# Altium project AutonomousVehicle_MotherBoard.PrjPcb (part 2 of 2)

## Sheet MotherBoard_Sensor_Communication.SchDoc
size A; SheetNumber: 7; SheetTotal: 9
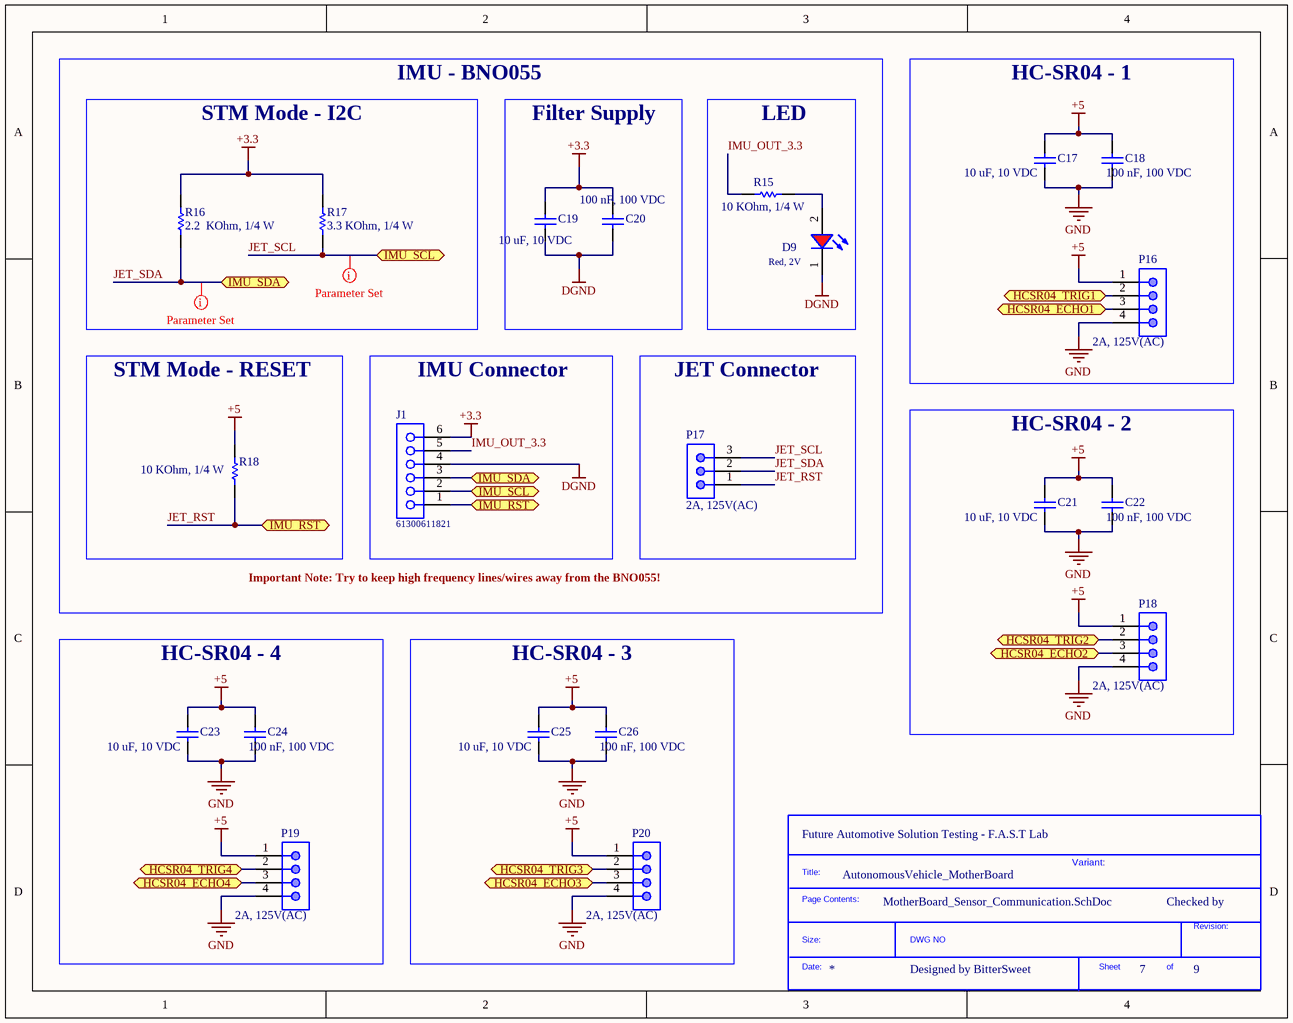
[diagram p6: MotherBoard_Sensor_Communication.SchDoc]

### Parts
(Parts that share a designator on the sheet are numbered #1, #2 ... from top to bottom, then left to right.)
*?#7  SDTitleBlock  (value not drawn)  (graphical)
C17  10 uF, 10 VDC  [CAP_0603]
C18  100 nF, 100 VDC  [CAP_0603]
C19  10 uF, 10 VDC  [CAP_0603]
C20  100 nF, 100 VDC  [CAP_0603]
C21  10 uF, 10 VDC  [CAP_0603]
C22  100 nF, 100 VDC  [CAP_0603]
C23  10 uF, 10 VDC  [CAP_0603]
C24  100 nF, 100 VDC  [CAP_0603]
C25  10 uF, 10 VDC  [CAP_0603]
C26  100 nF, 100 VDC  [CAP_0603]
D9  Red, 2V  [WL-SMCW_0603_H=0.7mm]
J1  61300611821  [61300611821]
P16  2A, 125V(AC)  [620104131822]
P17  2A, 125V(AC)  [620103131822]
P18  2A, 125V(AC)  [620104131822]
P19  2A, 125V(AC)  [620104131822]
P20  2A, 125V(AC)  [620104131822]
R15  10 KOhm, 1/4 W  [resistor_0603]
R16  2.2  KOhm, 1/4 W  [resistor_0603]
R17  3.3 KOhm, 1/4 W  [resistor_0603]
R18  10 KOhm, 1/4 W  [resistor_0603]

### Blocks framed on the sheet
HC-SR04 - 1: C17 C18 P16
Filter Supply: C19 C20
LED: D9 R15
STM Mode - RESET: R18
IMU Connector: J1
JET Connector: P17
HC-SR04 - 2: C21 C22 P18
HC-SR04 - 4: C23 C24 P19
HC-SR04 - 3: C25 C26 P20

### Ports
HCSR04_ECHO1 (bidir), HCSR04_ECHO2 (bidir), HCSR04_ECHO3 (bidir), HCSR04_ECHO4 (bidir), HCSR04_TRIG1 (bidir), HCSR04_TRIG2 (bidir), HCSR04_TRIG3 (bidir), HCSR04_TRIG4 (bidir), IMU_RST (bidir), IMU_SCL (bidir), IMU_SDA (bidir)

### Nets
+3.3: C19.2 C20.2 J1.6 R16.2 R17.2
+5: C17.2 C18.2 C21.2 C22.2 C23.2 C24.2 C25.2 C26.2 P16.1 P18.1 P19.1 P20.1 R18.2
DGND: C19.1 C20.1 D9.1(K) J1.4
GND: C17.1 C18.1 C21.1 C22.1 C23.1 C24.1 C25.1 C26.1 P16.4 P18.4 P19.4 P20.4
IMU_OUT_3.3: J1.5 R15.2
JET_RST: J1.1 P17.1 R18.1 ; port IMU_RST
JET_SCL: J1.2 P17.3 R17.1 ; port IMU_SCL
JET_SDA: J1.3 P17.2 R16.1 ; port IMU_SDA
NetD9_2: D9.2(A) R15.1
NetP16_2: P16.2 ; port HCSR04_TRIG1
NetP16_3: P16.3 ; port HCSR04_ECHO1
NetP18_2: P18.2 ; port HCSR04_TRIG2
NetP18_3: P18.3 ; port HCSR04_ECHO2
NetP19_2: P19.2 ; port HCSR04_TRIG4
NetP19_3: P19.3 ; port HCSR04_ECHO4
NetP20_2: P20.2 ; port HCSR04_TRIG3
NetP20_3: P20.3 ; port HCSR04_ECHO3

### Layout directives
net class IMU_I2C: JET_SCL, JET_SDA

### Notes on the sheet
- IMU - BNO055
- STM Mode - I2C
- Important Note: Try to keep high frequency lines/wires away from the BNO055!
- (near *?#7) Future Automotive Solution Testing - F.A.S.T Lab
- AutonomousVehicle_MotherBoard
- Variant:
- Checked by
- Designed by BitterSweet
- (in symbol SDTitleBlock) Title:; Page Contents:; Revision:; Size:; DWG NO; Date:; Sheet; of

### Library data of the parts
C17 C19 C21 C23 C25 = 0106031061010: CAP, size 0603, 10 uF, 10 VDC; Manufacture Name: Samsung Electro-Mechanics; Manufacture SN: CL10A106KP8NNWC; Capacitance: 10 uF; Tolerance: +/-10%; Voltage Rating DC: 10 VDC; ComponentLink2Description: Datasheet; ComponentLink2URL: https://www.mouser.vn/datasheet/2/585/MLCC-1837944.pdf; Operating Temperature: -55 to +125degC; Packaging: Tape and Reel; Mounting Technology: SMT; Size: 0603; Supplier 1 Name: Mouser; Supplier 1 SN: 187-CL10A106KP8NNWC; Supplier 1 URL: https://www.mouser.vn/ProductDetail/Samsung-Electro-Mechanics/CL10A106KP8NNWC?qs=xZ%2FP%252Ba9zWqZx8LSX23YqWA%3D%3D&utm_source=mouser-refine-download&utm_medium=file&utm_campaign=CL10A106KP8NNWC&utm_content=Samsung-Electro-Mechanics; Supplier 2 Name: Digi-Key; Supplier 2 SN: 1276-CL10A106KP8NNWCTR-ND; Supplier 2 URL: https://www.digikey.com/en/products/detail/samsung-electro-mechanics/cl10a106kp8nnwc/16572907; Supplier 3 Name: thegioiic; Supplier 3 SN: N/A; Supplier 3 URL: https://www.thegioiic.com/tu-gom-0603-10uf-25v; Value: 10 uF, 10 VDC; ComponentLink3Description: JLCPCB Link; ComponentLink3URL: https://jlcpcb.com/partdetail/Walsin_TechCorp-0603X106K100/C90806; JLCPCB Part: C90806
C18 C20 C22 C24 C26 = 0106031041050: CAP, size 0603, 100 nF, 16 VDC; Manufacture Name: TDK; Manufacture SN: CGA3E3X8R1H104K080AE; Capacitance: 100 nF; Tolerance: +/-10%; Voltage Rating DC: 16 VDC; ComponentLink2Description: Datasheet; ComponentLink2URL: https://product.tdk.com/system/files/dam/doc/product/capacitor/ceramic/mlcc/catalog/mlcc_automotive_soft_en.pdf?ref_disty=mouser; Operating Temperature: -55 to +125degC; Packaging: Tape and Reel; Mounting Technology: SMT; Size: 0603; Supplier 1 Name: Mouser; Supplier 1 SN: 810-CGA3E3X8R1H104KA; Supplier 1 URL: https://www.mouser.com/ProductDetail/TDK/CGA3E3X8R1H104K080AE?qs=nQSIdc08i%252Bd8g3IRRgU2bw%3D%3D&utm_source=mouser-refine-download&utm_medium=file&utm_campaign=CGA3E3X8R1H104K080AE&utm_content=TDK; Supplier 2 Name: Digi-Key; Supplier 2 SN: 445-173697-2-ND; Supplier 2 URL: https://www.digikey.com/en/products/detail/tdk-corporation/cga3e3x8r1h104k080ae/5809262; Supplier 3 Name: thegioiic; Supplier 3 SN: N/A; Supplier 3 URL: N/A; Value: 100 nF, 100 VDC; ComponentLink3Description: JLCPCB Link; ComponentLink3URL: https://jlcpcb.com/partdetail/89397-0603B104K101NT/C88219; JLCPCB Part: C88219
D9 = 160603RedClear: WL-SMCW SMT Mono-color Chip LED Waterclear, size 0603, Red, 2V, 140deg; Type: Clear; Color: Red; Size: 0603; ComponentLink1Description: Datasheet link; ComponentLink1URL: N/A; ComponentLink2Description: Supplier 1 URL; ComponentLink2URL: https://www.mouser.vn/ProductDetail/Wurth-Elektronik/150060RS75000?qs=LlUlMxKIyB3QnmZ3fw%2FVCA%3D%3D; ComponentLink3Description: Supplier 2 URL; ComponentLink3URL: https://www.digikey.com/en/products/detail/liteon/LTST-C191KRKT/386837; ComponentLink4Description: Supplier 3 URL; ComponentLink4URL: https://www.thegioiic.com/led-do-0603-dan-smd-trong-suot; Supplier 1 Name: Mouser; Supplier 1 SN: 710-150060RS75000; Supplier 1 URL: https://www.mouser.vn/ProductDetail/Wurth-Elektronik/150060RS75000?qs=LlUlMxKIyB3QnmZ3fw%2FVCA%3D%3D; Supplier 2 Name: Digi-Key; Supplier 2 SN: 160-1447-2-ND; Supplier 2 URL: https://www.digikey.com/en/products/detail/liteon/LTST-C191KRKT/386837; Supplier 3 Name: ICDayRoi; Supplier 3 SN: N/A; Supplier 3 URL: https://www.thegioiic.com/led-do-0603-dan-smd-trong-suot; Value: Red, 2V; ComponentLink5Description: JLCPCB Link; ComponentLink5URL: https://jlcpcb.com/partdetail/WURTHELEKTRONIK-150060RS75000/C3030991; JLCPCB Part: C3030991
J1 = 61300611821: WR-PHD Socket Header, THT, pitch 2.54mm, Single Row, Vertical, 6p; Manufacturer: Wurth Elektronik; Pin Number: 6; Rated Current: 3A; Working Voltage: 250VAC; Withstanding Voltage: 500VAC; Contact Resistance: 20mOhm; ComponentLink1Description: Manufacturer; ComponentLink1URL: http://www.we-online.de; ComponentLink2Description: Datasheet; ComponentLink2URL: https://www.we-online.com/catalog/datasheet/61300611821.pdf; Manufacturer Part Number: 61300611821; Published Date: May 2020; Pitch: 2.54mm; Operating Temperature: -40 to +125degC; Mounting Technology: THT; Packaging: Tray; Gender: Socket Header; Row Number: Single; Orientation: Vertical; ComponentLink3Description: Global Supply; ComponentLink3URL: https://www.we-online.com/en/components/products/PHD_2_54_SOCKET_HEADER_6130XX11821?sq=61300611821#61300611821; ComponentLink4Description: Global Supply; ComponentLink4URL: https://www.mouser.vn/ProductDetail/Wurth-Elektronik/61300611821?qs=iLbezkQI%252BsgS21jF2eozhA%3D%3D; ComponentLink5Description: Local Supply; ComponentLink5URL: https://www.thegioiic.com/hang-rao-cai-don-2-54mm-6-chan-1-hang-cao-11-8mm-xuyen-lo; Supplier 1 Name: Mouser; Supplier 1 SN: 710-61300611821; Supplier 1 URL: https://www.mouser.vn/ProductDetail/Wurth-Elektronik/61300611821?qs=iLbezkQI%252BsgS21jF2eozhA%3D%3D; Supplier 2 Name: Digi-Key; Supplier 2 SN: N/A; Supplier 2 URL: N/A; Supplier 3 Name: thegioiic; Supplier 3 SN: N/A; Supplier 3 URL: https://www.thegioiic.com/hang-rao-cai-don-2-54mm-6-chan-1-hang-cao-11-8mm-xuyen-lo
P16 P18-P20 = 620104131822: WR-WTB SMT Male Horizontal Shrouded Header, pitch 2mm, 4p; Pin Number: 4; Contact Resistance: 20mOhm; Withstanding Voltage: 800VAC; Working Voltage: 100VAC; ComponentLink1Description: Manufacturer; ComponentLink1URL: http://www.we-online.de; ComponentLink2Description: Datasheet; ComponentLink2URL: https://www.we-online.com/catalog/datasheet/620104131822.pdf; Pitch: 2mm; Published Date: January 2020; Publisher: Wurth Elektronik; Mounting Technology: SMT; Packaging: Tape and Reel; Operating Temperature: -25 to +85degC; Part Number: 620104131822; Gender: Male; Type: Horizontal; Rated Current: 2A; ComponentLink3Description: Global Supply; ComponentLink3URL: https://www.we-online.com/en/components/products/WTB_2_00_SMT_MALE_HORIZONTAL_SHROUDED_HEADER_6201XX131822?sq=620104131822#620104131822; ComponentLink4Description: Global Supply; ComponentLink4URL: https://www.mouser.vn/ProductDetail/Wurth-Elektronik/620104131822?qs=ZtY9WdtwX57A7D%2FbILyVEQ%3D%3D; Supplier 1 Name: Mouser; Supplier 1 SN: 710-620104131822; Supplier 1 URL: https://www.mouser.vn/ProductDetail/Wurth-Elektronik/620104131822?qs=ZtY9WdtwX57A7D%2FbILyVEQ%3D%3D; Supplier 2 Name: Digi-Key; Supplier 2 SN: N/A; Supplier 2 URL: N/A; Supplier 3 Name: thegioiic; Supplier 3 SN: N/A; Supplier 3 URL: https://www.thegioiic.com/dau-ph2-0mm-4-chan-dan-smd-nam-ngang; Value: 2A, 125V(AC)
P17 = 620103131822: WR-WTB SMT Male Horizontal Shrouded Header, pitch 2mm, 3p; Pin Number: 3; Contact Resistance: 20mOhm; Withstanding Voltage: 800VAC; Working Voltage: 100VAC; ComponentLink1Description: Manufacturer; ComponentLink1URL: http://www.we-online.de; ComponentLink2Description: Datasheet; ComponentLink2URL: https://www.we-online.com/catalog/datasheet/620103131822.pdf; Pitch: 2mm; Published Date: January 2020; Publisher: Wurth Elektronik; Mounting Technology: SMT; Packaging: Tape and Reel; Operating Temperature: -25 to +85degC; Part Number: 620103131822; Gender: Male; Type: Horizontal; Rated Current: 2A; ComponentLink3Description: Global Supply; ComponentLink3URL: https://www.we-online.com/en/components/products/WTB_2_00_SMT_MALE_HORIZONTAL_SHROUDED_HEADER_6201XX131822?sq=620103131822#620103131822; ComponentLink4Description: Global Supply; ComponentLink4URL: https://www.mouser.vn/ProductDetail/Wurth-Elektronik/620103131822?qs=ZtY9WdtwX54jBicvPVEzcw%3D%3D; Supplier 1 Name: Mouser; Supplier 1 SN: 710-620103131822; Supplier 1 URL: https://www.mouser.vn/ProductDetail/Wurth-Elektronik/620103131822?qs=ZtY9WdtwX54jBicvPVEzcw%3D%3D; Supplier 2 Name: Digi-Key; Supplier 2 SN: N/A; Supplier 2 URL: N/A; Supplier 3 Name: thegioiic; Supplier 3 SN: N/A; Supplier 3 URL: N/A; Value: 2A, 125V(AC)
R15 R18 = 0006031031: RES, size 0603, 10 KOhm, 1/4 W; Manufacture  Name: OEM; Resistance: 10 KOhm; Rated Power: 1/4 W; Resistance Tolerance: +/-1%; Size: 0603; Mounting Technology: SMT; Supplier 1 Name: Mouser; Supplier 1 SN: 755-ESR03EZPF1002; Supplier 2 Name: Digi-Key; Supplier 2 SN: RHM10KADTR-ND RHM10KADCT-ND RHM10KADDKR-ND; Supplier 1 URL: https://www.mouser.vn/ProductDetail/ROHM-Semiconductor/ESR03EZPF1002?qs=sGAEpiMZZMvdGkrng054t67Efho1F8r6CDeAsqwFse8%3D; Supplier 3 Name: thegioiic; Supplier 3 SN: N/A; Supplier 3 URL: N/A; Manufacture  SN: OEM; Value: 10 KOhm, 1/4 W; ComponentLink1Description: Datasheet link; ComponentLink1URL: https://fscdn.rohm.com/en/products/databook/datasheet/passive/resistor/chip_resistor/esr-e.pdf; ComponentLink2Description: Supplier 1 URL; ComponentLink2URL: https://www.thegioiic.com/dien-tro-10-kohm-0603-1-; ComponentLink3Description: Supplier 2 URL; ComponentLink3URL: https://www.digikey.com/en/products/detail/rohm-semiconductor/ESR03EZPF1002/1983429; ComponentLink4Description: Supplier 3 URL; ComponentLink4URL: N/A; Supplier 2 URL: https://www.digikey.com/en/products/detail/rohm-semiconductor/ESR03EZPF1002/1983429; JLCPCB Part: C2087321; Parameter 1: *; ComponentLink5Description: JLCPCB Link; ComponentLink5URL: https://jlcpcb.com/partdetail/Yageo-RT0603BRD1010KL/C2087321
R16 = 0006032221: RES, size 0603, 2.2  KOhm, 1/4 W; Manufacture  Name: OEM; Rated Power: 1/4 W; Resistance Tolerance: +/-1%; Size: 0603; Mounting Technology: SMT; Resistance: 2.2  KOhm; Supplier 1 Name: Mouser; Supplier 1 SN: 603-SR0603FR-7T2K2L; Supplier 1 URL: https://www.mouser.vn/ProductDetail/YAGEO/SR0603FR-7T2K2L?qs=pfd5qewlna6SQQIuviAJZA%3D%3D; Supplier 2 Name: Digi-Key; Supplier 2 SN: 13-RC0603FR-132K2LTR-ND; Supplier 3 Name: thegioiic; Supplier 3 SN: N/A; Supplier 3 URL: https://www.thegioiic.com/dien-tro-2-2-kohm-0603-1-; Manufacture  SN: OEM; Value: 2.2  KOhm, 1/4 W; ComponentLink1Description: Datasheet link; ComponentLink1URL: N/A; ComponentLink2Description: Supplier 1 URL; ComponentLink2URL: N/A; ComponentLink3Description: Supplier 2 URL; ComponentLink3URL: https://www.digikey.com/en/products/detail/yageo/RC0603FR-132K2L/13694214; ComponentLink4Description: Supplier 3 URL; ComponentLink4URL: N/A; Supplier 2 URL: https://www.digikey.com/en/products/detail/yageo/RC0603FR-132K2L/13694214; ComponentLink5Description: JLCPCB Link; ComponentLink5URL: https://jlcpcb.com/partdetail/Resi-AECR0603F2K20K9/C328351; JLCPCB Part: C328351
R17 = 0006033321: RES, size 0603, 3.3 KOhm, 1/4 W; Manufacture  Name: OEM; Rated Power: 1/4 W; Resistance Tolerance: +/-1%; Resistance: 3.3 KOhm; Size: 0603; Mounting Technology: SMT; Supplier 1 Name: Mouser; Supplier 1 SN: 667-ERJ-PA3F3301V; Supplier 2 Name: Digi-Key; Supplier 2 SN: 10-ERJ-UP3F3301VTR-ND 10-ERJ-UP3F3301VCT-ND 10-ERJ-UP3F3301VDKR-ND; Supplier 1 URL: https://www.mouser.vn/ProductDetail/Panasonic/ERJ-PA3F3301V?qs=sGAEpiMZZMvdGkrng054t6%2FAfIpq60YDpB2wwO%252BBqIBQy72ynM%2FI9Q%3D%3D; Supplier 3 Name: thegioiic; Supplier 3 SN: N/A; Supplier 3 URL: https://www.thegioiic.com/dien-tro-3-3-kohm-0603-1-; Manufacture  SN: OEM; Value: 3.3 KOhm, 1/4 W; ComponentLink1Description: Datasheet link; ComponentLink1URL: https://api.pim.na.industrial.panasonic.com/file_stream/main/fileversion/4484; ComponentLink2Description: Supplier 1 URL; ComponentLink2URL: N/A; ComponentLink3Description: Supplier 2 URL; ComponentLink3URL: https://www.digikey.com/en/products/detail/panasonic-electronic-components/ERJ-UP3F3301V/12093093; ComponentLink4Description: Supplier 3 URL; ComponentLink4URL: N/A; Supplier 2 URL: https://www.digikey.com/en/products/detail/panasonic-electronic-components/ERJ-UP3F3301V/12093093; ComponentLink5Description: JLCPCB Link; ComponentLink5URL: https://jlcpcb.com/partdetail/Bourns-CR0603_FX3301ELF/C203527; JLCPCB Part: C203527

## Sheet MotherBoard_Test_Support.SchDoc
size A; SheetNumber: 8; SheetTotal: 9
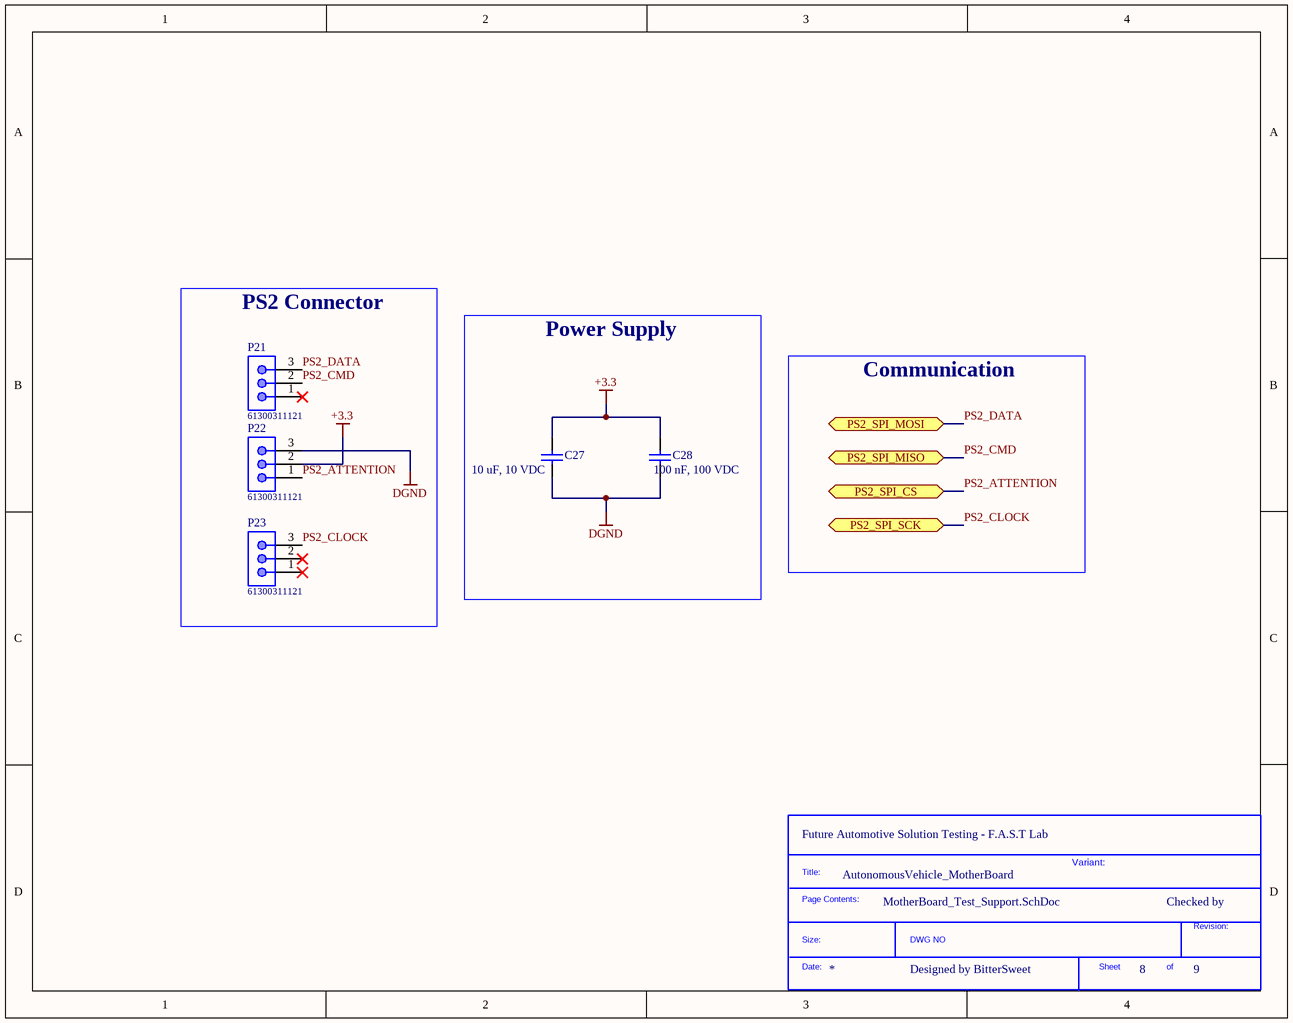
[diagram p7: MotherBoard_Test_Support.SchDoc]

### Parts
(Parts that share a designator on the sheet are numbered #1, #2 ... from top to bottom, then left to right.)
*?#8  SDTitleBlock  (value not drawn)  (graphical)
C27  10 uF, 10 VDC  [CAP_0603]
C28  100 nF, 100 VDC  [CAP_0603]
P21  61300311121  [61300311121]
P22  61300311121  [61300311121]
P23  61300311121  [61300311121]

### Blocks framed on the sheet
PS2 Connector: P21-P23
Power Supply: C27 C28

### Ports
PS2_SPI_CS (bidir), PS2_SPI_MISO (bidir), PS2_SPI_MOSI (bidir), PS2_SPI_SCK (bidir)

### Nets
+3.3: C27.2 C28.2 P22.2
DGND: C27.1 C28.1 P22.3
PS2_ATTENTION: P22.1 ; port PS2_SPI_CS
PS2_CLOCK: P23.3 ; port PS2_SPI_SCK
PS2_CMD: P21.2 ; port PS2_SPI_MISO
PS2_DATA: P21.3 ; port PS2_SPI_MOSI

Not connected (* = marked no-connect by the designer): P21 1*; P23 1* 2*

### Notes on the sheet
- Communication
- (near *?#8) Future Automotive Solution Testing - F.A.S.T Lab
- AutonomousVehicle_MotherBoard
- Variant:
- Checked by
- Designed by BitterSweet
- (in symbol SDTitleBlock) Title:; Page Contents:; Revision:; Size:; DWG NO; Date:; Sheet; of

### Library data of the parts
C27 = 0106031061010: as C17 on sheet MotherBoard_Sensor_Communication; ComponentLink2Description: Datasheet; ComponentLink2URL: https://www.mouser.vn/datasheet/2/585/MLCC-1837944.pdf; Operating Temperature: -55 to +125degC; Packaging: Tape and Reel; Mounting Technology: SMT; Size: 0603; Supplier 1 Name: Mouser; Supplier 1 SN: 187-CL10A106KP8NNWC; Supplier 1 URL: https://www.mouser.vn/ProductDetail/Samsung-Electro-Mechanics/CL10A106KP8NNWC?qs=xZ%2FP%252Ba9zWqZx8LSX23YqWA%3D%3D&utm_source=mouser-refine-download&utm_medium=file&utm_campaign=CL10A106KP8NNWC&utm_content=Samsung-Electro-Mechanics; Supplier 2 Name: Digi-Key; Supplier 2 SN: 1276-CL10A106KP8NNWCTR-ND; Supplier 2 URL: https://www.digikey.com/en/products/detail/samsung-electro-mechanics/cl10a106kp8nnwc/16572907; Supplier 3 Name: thegioiic; Supplier 3 SN: N/A; Supplier 3 URL: https://www.thegioiic.com/tu-gom-0603-10uf-25v; Value: 10 uF, 10 VDC; ComponentLink3Description: JLCPCB Link; ComponentLink3URL: https://jlcpcb.com/partdetail/Walsin_TechCorp-0603X106K100/C90806; JLCPCB Part: C90806
C28 = 0106031041050: as C18 on sheet MotherBoard_Sensor_Communication; ComponentLink2Description: Datasheet; ComponentLink2URL: https://product.tdk.com/system/files/dam/doc/product/capacitor/ceramic/mlcc/catalog/mlcc_automotive_soft_en.pdf?ref_disty=mouser; Operating Temperature: -55 to +125degC; Packaging: Tape and Reel; Mounting Technology: SMT; Size: 0603; Supplier 1 Name: Mouser; Supplier 1 SN: 810-CGA3E3X8R1H104KA; Supplier 1 URL: https://www.mouser.com/ProductDetail/TDK/CGA3E3X8R1H104K080AE?qs=nQSIdc08i%252Bd8g3IRRgU2bw%3D%3D&utm_source=mouser-refine-download&utm_medium=file&utm_campaign=CGA3E3X8R1H104K080AE&utm_content=TDK; Supplier 2 Name: Digi-Key; Supplier 2 SN: 445-173697-2-ND; Supplier 2 URL: https://www.digikey.com/en/products/detail/tdk-corporation/cga3e3x8r1h104k080ae/5809262; Supplier 3 Name: thegioiic; Supplier 3 SN: N/A; Supplier 3 URL: N/A; Value: 100 nF, 100 VDC; ComponentLink3Description: JLCPCB Link; ComponentLink3URL: https://jlcpcb.com/partdetail/89397-0603B104K101NT/C88219; JLCPCB Part: C88219
P21-P23 = 61300311121: WR-PHD Pin Header, THT, pitch 2.54mm, Single Row, Vertical, 3p; Manufacturer: Wurth Elektronik; Pin Number: 3; Rated Current: 3A; Working Voltage: 250VAC; Withstanding Voltage: 500VAC; Contact Resistance: 20mOhm; Supply Name 1: Mouser; ComponentLink1Description: Manufacturer; ComponentLink1URL: http://www.we-online.de; ComponentLink2Description: Datasheet; ComponentLink2URL: https://www.we-online.com/catalog/datasheet/61300311121.pdf; Manufacturer Part Number: 61300311121; Published Date: May 2020; Pitch: 2.54mm; Operating Temperature: -40 to +105degC; Mounting Technology: THT; Packaging: Bag; Gender: Pin Header; Row Number: Single; Orientation: Vertical; ComponentLink3Description: Global Supply; ComponentLink3URL: https://www.mouser.vn/ProductDetail/Wurth-Elektronik/61300311121?qs=PhR8RmCirEYxRWFJzNKsUw%3D%3D; Supplier 1 Name: Mouser; Supplier 1 SN: 710-61300311121; Supplier 1 URL: https://www.mouser.vn/ProductDetail/Wurth-Elektronik/61300311121?qs=PhR8RmCirEYxRWFJzNKsUw%3D%3D; Supplier 2 Name: Digi-Key; Supplier 2 SN: N/A; Supplier 2 URL: N/A; Supplier 3 Name: thegioiic; Supplier 3 SN: N/A; Supplier 3 URL: N/A

## Sheet MotherBoard_JetsonSupport.SchDoc
size A; SheetNumber: 9; SheetTotal: 9
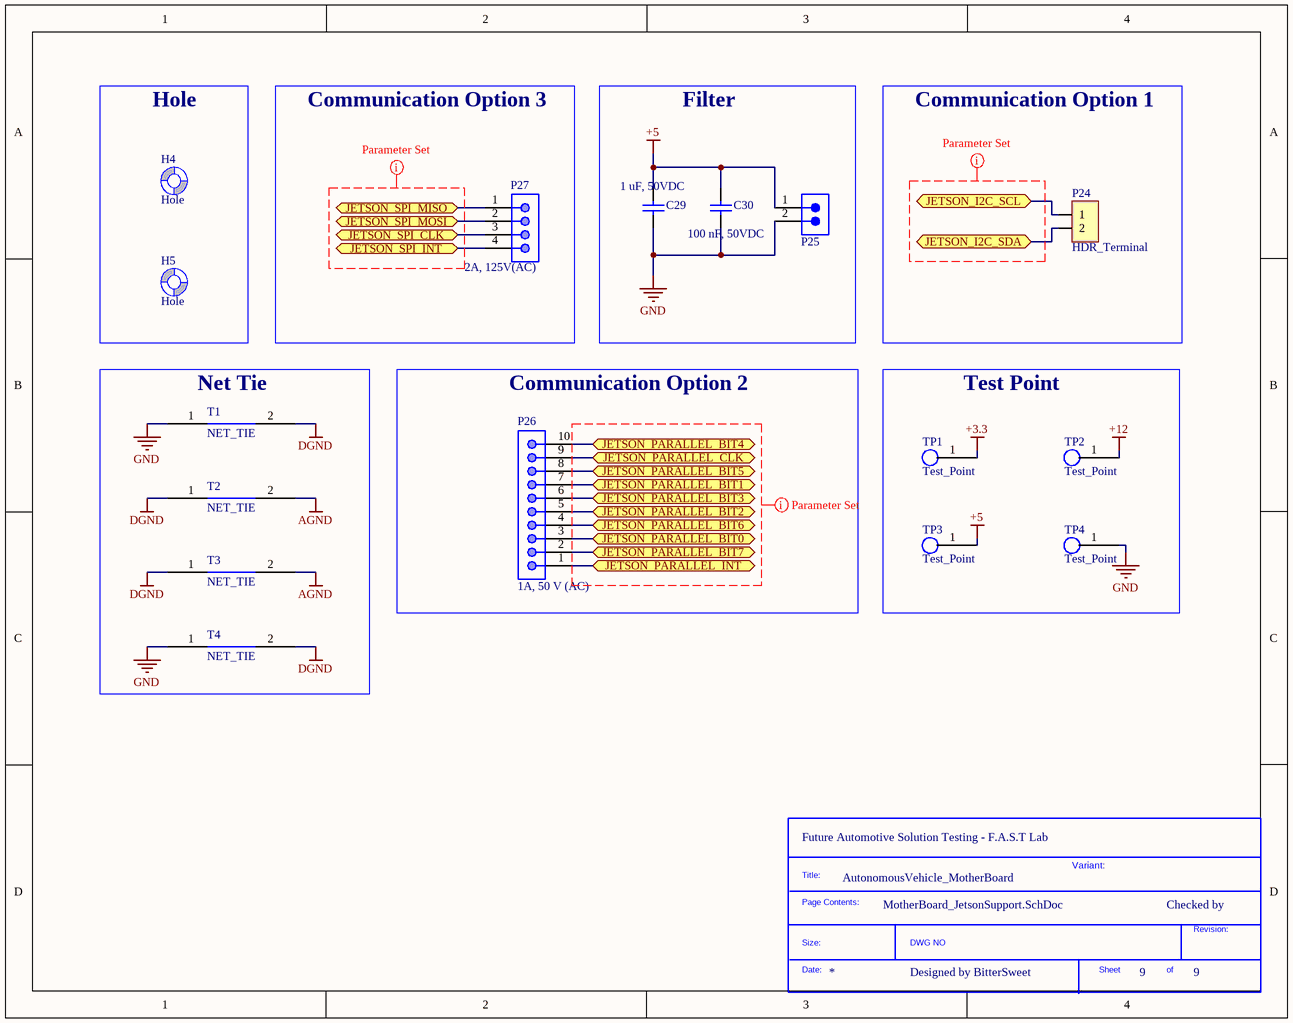
[diagram p8: MotherBoard_JetsonSupport.SchDoc]

### Parts
(Parts that share a designator on the sheet are numbered #1, #2 ... from top to bottom, then left to right.)
*?#9  SDTitleBlock  (value not drawn)  (graphical)
C29  1 uF, 50VDC  [CAP_RADIAL_2.54]
C30  100 nF, 50VDC  [CAP_RADIAL_2.54]
H4  Hole  [Hole_3.2mm]
H5  Hole  [Hole_3.2mm]
P24  HDR_Terminal  [HDR_HEADER_2.0_HORIZONTAL]
P25  10A, 300V  [691321300002]  (value not drawn)
P26  1A, 50 V (AC)  [648110131822]
P27  2A, 125V(AC)  [620104131822]
T1  NET_TIE  [NET_TIE_2.0mm]
T2  NET_TIE  [NET_TIE_0.5MM]
T3  NET_TIE  [NET_TIE_0.5MM]
T4  NET_TIE  [NET_TIE_2.0mm]
TP1  Test_Point  [TP_1_5mm_SMD]
TP2  Test_Point  [TP_1_5mm_SMD]
TP3  Test_Point  [TP_1_5mm_SMD]
TP4  Test_Point  [TP_1_5mm_SMD]

### Blocks framed on the sheet
Hole: H4 H5
Communication Option 3: P27
Filter: C29 C30 P25
Communication Option 1: P24
Net Tie: T1-T4
Communication Option 2: P26
Test Point: TP1-TP4

### Ports
JETSON_I2C_SCL (bidir), JETSON_I2C_SDA (bidir), JETSON_PARALLEL_BIT0 (bidir), JETSON_PARALLEL_BIT1 (bidir), JETSON_PARALLEL_BIT2 (bidir), JETSON_PARALLEL_BIT3 (bidir), JETSON_PARALLEL_BIT4 (bidir), JETSON_PARALLEL_BIT5 (bidir), JETSON_PARALLEL_BIT6 (bidir), JETSON_PARALLEL_BIT7 (bidir), JETSON_PARALLEL_CLK (bidir), JETSON_PARALLEL_INT (bidir), JETSON_SPI_CLK (bidir), JETSON_SPI_INT (bidir), JETSON_SPI_MISO (bidir), JETSON_SPI_MOSI (bidir)

### Nets
+3.3: TP1.1
+5: C29.1 C30.1 P25.1 TP3.1
+12: TP2.1
AGND: T2.2 T3.2
DGND: T1.2 T2.1 T3.1 T4.2
GND: C29.2 C30.2 P25.2 T1.1 T4.1 TP4.1
NetP24_1: P24.1 ; port JETSON_I2C_SCL
NetP24_2: P24.2 ; port JETSON_I2C_SDA
NetP26_1: P26.1 ; port JETSON_PARALLEL_INT
NetP26_2: P26.2 ; port JETSON_PARALLEL_BIT7
NetP26_3: P26.3 ; port JETSON_PARALLEL_BIT0
NetP26_4: P26.4 ; port JETSON_PARALLEL_BIT6
NetP26_5: P26.5 ; port JETSON_PARALLEL_BIT2
NetP26_6: P26.6 ; port JETSON_PARALLEL_BIT3
NetP26_7: P26.7 ; port JETSON_PARALLEL_BIT1
NetP26_8: P26.8 ; port JETSON_PARALLEL_BIT5
NetP26_9: P26.9 ; port JETSON_PARALLEL_CLK
NetP26_10: P26.10 ; port JETSON_PARALLEL_BIT4
NetP27_1: P27.1 ; port JETSON_SPI_MISO
NetP27_2: P27.2 ; port JETSON_SPI_MOSI
NetP27_3: P27.3 ; port JETSON_SPI_CLK
NetP27_4: P27.4 ; port JETSON_SPI_INT

Not connected (* = marked no-connect by the designer): H4 1(Screw); H5 1(Screw)

### Layout directives
net class ParallelCommunication: (no net found under the mark)
net class JETSON_I2C: (no net found under the mark)
net class JETSON_SPI: (no net found under the mark)

### Notes on the sheet
- (near *?#9) Future Automotive Solution Testing - F.A.S.T Lab
- AutonomousVehicle_MotherBoard
- Variant:
- Checked by
- Designed by BitterSweet
- (in symbol SDTitleBlock) Title:; Page Contents:; Revision:; Size:; DWG NO; Date:; Sheet; of

### Library data of the parts
C29 C30 = Capacitor: ComponentLink1Description: ThegioiIC Link
  C29: ComponentLink1URL: https://www.thegioiic.com/tu-gom-multilayer-1uf-50v
  C30: ComponentLink1URL: https://www.thegioiic.com/tu-gom-tron-100nf-0-1uf-50v
P24 = HDR_Terminal: HDR_Terminal 2 pin; Supplier: ThegioiIC; ComponentLink1Description: URL; ComponentLink1URL: https://www.thegioiic.com/kf128-2-v-domino-2-chan-thang-3-5mm-300v-10a-han-pcb
P25 = 691321300002: WR-TBL Series 321 Vertical PCB Header, THT, pitch 3.81mm, 2p; Manufacturer: Wurth Elektronik; Modularity: No; ComponentLink1Description: Datasheet Link; ComponentLink1URL: https://www.we-online.com/redexpert/spec/691321300002?ad; ComponentLink2Description: Supplier 1 URL; ComponentLink2URL: N/A; Manufacturer Part Number: 691321300002; Category: Terminal Blocks; Match Code: WR-TBL; Mount: Through Hole; Operating Temperature Max: 105°C; Operating Temperature Min: -40°C; Packaging: Box; Application: Pluggable; Number of Pins: 2; Number of Rows: 1; Orientation: Vertical; Pitch: 3.81mm; Rated Current: 10A; Working Voltage: 300V; ComponentLink3Description: Supplier 2 URL; ComponentLink3URL: N/A; ComponentLink4Description: Supplier 3 URL; ComponentLink4URL: https://www.thegioiic.com/ul-3-81-2-v-terminal-block-plug-in-han-pcb-2-chan-thang-3-81mm-300v-10a-ulo; Supplier 1 Name: Mouser; Supplier 1 SN: N/A; Supplier 1 URL: N/A; Supplier 2 Name: Digi-Key; Supplier 2 SN: N/A; Supplier 2 URL: N/A; Supplier 3 Name: thegioiic; Supplier 3 SN: N/A; Supplier 3 URL: https://www.thegioiic.com/ul-3-81-2-v-terminal-block-plug-in-han-pcb-2-chan-thang-3-81mm-300v-10a-ulo; Value: 10A, 300V
P26 = 648110131822: WR-WTB SMT Male Horizontal Shrouded Header, pitch 1.5mm, 10p; Pin Number: 10; Contact Resistance: 20mOhm; Withstanding Voltage: 500VAC; Working Voltage: 50VAC; ComponentLink1Description: Manufacturer; ComponentLink1URL: http://www.we-online.de; ComponentLink2Description: Datasheet; ComponentLink2URL: https://www.we-online.com/catalog/datasheet/648110131822.pdf; Pitch: 1.5mm; Published Date: January 2020; Publisher: Wurth Elektronik; Mounting Technology: SMT; Packaging: Tape and Reel; Operating Temperature: -25 to +85degC; Part Number: 648110131822; Gender: Male; Type: Horizontal; Rated Current: 1A; ComponentLink3Description: Global Supply; ComponentLink3URL: https://www.we-online.com/en/components/products/WTB_1_50_SMT_MALE_HORIZONTAL_SHROUDED_HEADER_6481XX131822?sq=648110131822#648110131822; ComponentLink4Description: Global Supply; ComponentLink4URL: https://www.mouser.vn/ProductDetail/Wurth-Elektronik/648110131822?qs=3RJ0PdSuLVmrqG7i4WUbBw%3D%3D; Supplier 1 Name: Mouser; Supplier 1 SN: N/A; Supplier 1 URL: N/A; Supplier 2 Name: Digi-Key; Supplier 2 SN: N/A; Supplier 2 URL: N/A; Supplier 3 Name: thegioiic; Supplier 3 SN: N/A; Supplier 3 URL: N/A; Value: 1A, 50 V (AC)
P27 = 620104131822: as P16 on sheet MotherBoard_Sensor_Communication; ComponentLink1Description: Manufacturer; ComponentLink1URL: http://www.we-online.de; ComponentLink2Description: Datasheet; ComponentLink2URL: https://www.we-online.com/catalog/datasheet/620104131822.pdf; Pitch: 2mm; Published Date: January 2020; Publisher: Wurth Elektronik; Mounting Technology: SMT; Packaging: Tape and Reel; Operating Temperature: -25 to +85degC; Part Number: 620104131822; Gender: Male; Type: Horizontal; Rated Current: 2A; ComponentLink3Description: Global Supply; ComponentLink3URL: https://www.we-online.com/en/components/products/WTB_2_00_SMT_MALE_HORIZONTAL_SHROUDED_HEADER_6201XX131822?sq=620104131822#620104131822; ComponentLink4Description: Global Supply; ComponentLink4URL: https://www.mouser.vn/ProductDetail/Wurth-Elektronik/620104131822?qs=ZtY9WdtwX57A7D%2FbILyVEQ%3D%3D; Supplier 1 Name: Mouser; Supplier 1 SN: 710-620104131822; Supplier 1 URL: https://www.mouser.vn/ProductDetail/Wurth-Elektronik/620104131822?qs=ZtY9WdtwX57A7D%2FbILyVEQ%3D%3D; Supplier 2 Name: Digi-Key; Supplier 2 SN: N/A; Supplier 2 URL: N/A; Supplier 3 Name: thegioiic; Supplier 3 SN: N/A; Supplier 3 URL: https://www.thegioiic.com/dau-ph2-0mm-4-chan-dan-smd-nam-ngang; Value: 2A, 125V(AC)
T1-T4 = NET_TIE: Straight Net Tie

## Nets that join several sheets
+3.3: MotherBoard_NucleoF401RE (8 pins), MotherBoard_Driver_Communication (Q5.1 R11.2), MotherBoard_Sensor_Communication (5 pins), MotherBoard_Test_Support (C27.2 C28.2 P22.2), MotherBoard_JetsonSupport (TP1.1)
+5: MotherBoard_NucleoF401RE (8 pins), MotherBoard_AuxiliarySystem (5 pins), MotherBoard_Driver_Communication (P9.3 P10.3 R12.2), MotherBoard_Sensor_Communication (13 pins), MotherBoard_JetsonSupport (C29.1 C30.1 P25.1 TP3.1)
+12: MotherBoard_AuxiliarySystem (11 pins), MotherBoard_JetsonSupport (TP2.1)
AGND: MotherBoard_NucleoF401RE (U1.CN10_32), MotherBoard_Measure_Communication (P14.2 P15.2), MotherBoard_JetsonSupport (T2.2 T3.2)
DGND: MotherBoard_NucleoF401RE (10 pins), MotherBoard_Measure_Communication (P13.2), MotherBoard_Sensor_Communication (C19.1 C20.1 D9.1 J1.4), MotherBoard_Test_Support (C27.1 C28.1 P22.3), MotherBoard_JetsonSupport (T1.2 T2.1 T3.1 T4.2)
GND: MotherBoard_NucleoF401RE (10 pins), MotherBoard_AuxiliarySystem (15 pins), MotherBoard_Driver_Communication (P9.1), MotherBoard_Sensor_Communication (12 pins), MotherBoard_JetsonSupport (6 pins)
NetP10_1: MotherBoard_NucleoF401RE (U1.CN10_23), MotherBoard_Driver_Communication (P10.1)
NetP10_2: MotherBoard_NucleoF401RE (U1.CN10_21), MotherBoard_Driver_Communication (P10.2)
NetP11_1: MotherBoard_NucleoF401RE (U1.CN7_35), MotherBoard_Driver_Communication (P11.1)
NetP11_2: MotherBoard_NucleoF401RE (U1.CN7_37), MotherBoard_Driver_Communication (P11.2)
NetP11_3: MotherBoard_NucleoF401RE (U1.CN10_30), MotherBoard_Driver_Communication (P11.3)
NetP12_1: MotherBoard_NucleoF401RE (U1.CN10_26), MotherBoard_Driver_Communication (P12.1)
NetP12_2: MotherBoard_NucleoF401RE (U1.CN10_12), MotherBoard_Driver_Communication (P12.2)
NetP12_3: MotherBoard_NucleoF401RE (U1.CN10_14), MotherBoard_Driver_Communication (P12.3)
NetP13_1: MotherBoard_NucleoF401RE (U1.CN7_28), MotherBoard_Measure_Communication (P13.1)
NetP14_1: MotherBoard_NucleoF401RE (U1.CN7_38), MotherBoard_Measure_Communication (P14.1)
NetP15_1: MotherBoard_NucleoF401RE (U1.CN7_32), MotherBoard_Measure_Communication (P15.1)
NetP16_2: MotherBoard_NucleoF401RE (U1.CN10_6), MotherBoard_Sensor_Communication (P16.2)
NetP16_3: MotherBoard_NucleoF401RE (U1.CN7_17), MotherBoard_Sensor_Communication (P16.3)
NetP18_2: MotherBoard_NucleoF401RE (U1.CN10_24), MotherBoard_Sensor_Communication (P18.2)
NetP18_3: MotherBoard_NucleoF401RE (U1.CN7_30), MotherBoard_Sensor_Communication (P18.3)
NetP19_2: MotherBoard_NucleoF401RE (U1.CN10_16), MotherBoard_Sensor_Communication (P19.2)
NetP19_3: MotherBoard_NucleoF401RE (U1.CN10_37), MotherBoard_Sensor_Communication (P19.3)
NetP20_2: MotherBoard_NucleoF401RE (U1.CN10_22), MotherBoard_Sensor_Communication (P20.2)
NetP20_3: MotherBoard_NucleoF401RE (U1.CN10_35), MotherBoard_Sensor_Communication (P20.3)
NetP24_1: MotherBoard_NucleoF401RE (U1.CN10_17), MotherBoard_JetsonSupport (P24.1)
NetP24_2: MotherBoard_NucleoF401RE (U1.CN7_21), MotherBoard_JetsonSupport (P24.2)
NetP26_1: MotherBoard_NucleoF401RE (U1.CN7_23), MotherBoard_JetsonSupport (P26.1)
NetP26_2: MotherBoard_NucleoF401RE (U1.CN7_25), MotherBoard_JetsonSupport (P26.2)
NetP26_3: MotherBoard_NucleoF401RE (U1.CN7_27), MotherBoard_JetsonSupport (P26.3)
NetP26_4: MotherBoard_NucleoF401RE (U1.CN7_4), MotherBoard_JetsonSupport (P26.4)
NetP26_5: MotherBoard_NucleoF401RE (U1.CN7_2), MotherBoard_JetsonSupport (P26.5)
NetP26_6: MotherBoard_NucleoF401RE (U1.CN7_1), MotherBoard_JetsonSupport (P26.6)
NetP26_7: MotherBoard_NucleoF401RE (U1.CN7_3), MotherBoard_JetsonSupport (P26.7)
NetP26_8: MotherBoard_NucleoF401RE (U1.CN10_3), MotherBoard_JetsonSupport (P26.8)
NetP26_9: MotherBoard_NucleoF401RE (U1.CN10_5), MotherBoard_JetsonSupport (P26.9)
NetP26_10: MotherBoard_NucleoF401RE (U1.CN10_25), MotherBoard_JetsonSupport (P26.10)
NetP27_1: MotherBoard_NucleoF401RE (U1.CN10_27), MotherBoard_JetsonSupport (P27.1)
NetP27_2: MotherBoard_NucleoF401RE (U1.CN10_29), MotherBoard_JetsonSupport (P27.2)
NetP27_3: MotherBoard_NucleoF401RE (U1.CN10_31), MotherBoard_JetsonSupport (P27.3)
NetP27_4: MotherBoard_NucleoF401RE (U1.CN10_28), MotherBoard_JetsonSupport (P27.4)
NetQ5_2: MotherBoard_NucleoF401RE (U1.CN10_33), MotherBoard_Driver_Communication (Q5.2 R11.1)
NetR3_1: MotherBoard_NucleoF401RE (U1.CN10_2), MotherBoard_AuxiliarySystem (R3.1)
NetR4_1: MotherBoard_NucleoF401RE (U1.CN10_4), MotherBoard_AuxiliarySystem (R4.1)
NetR5_1: MotherBoard_NucleoF401RE (U1.CN10_19), MotherBoard_AuxiliarySystem (R5.1)
NetR9_1: MotherBoard_NucleoF401RE (U1.CN7_34), MotherBoard_AuxiliarySystem (R9.1)
PS2_ATTENTION: MotherBoard_NucleoF401RE (U1.CN10_34), MotherBoard_Test_Support (P22.1)
PS2_CLOCK: MotherBoard_NucleoF401RE (U1.CN10_11), MotherBoard_Test_Support (P23.3)
PS2_CMD: MotherBoard_NucleoF401RE (U1.CN10_13), MotherBoard_Test_Support (P21.2)
PS2_DATA: MotherBoard_NucleoF401RE (U1.CN10_15), MotherBoard_Test_Support (P21.3)